# Altium schematic sheet Sheet1.SchDoc: ELECTENG 770 Smart Scale Interface Board
size A4; Author: Andy Woo; Revision: 2.1; SheetNumber: 1; SheetTotal: 1; ENG_APP_DATE: --/--/--; DSN_APP_DATE: --/--/--; CHK_APP_DATE: --/--/--
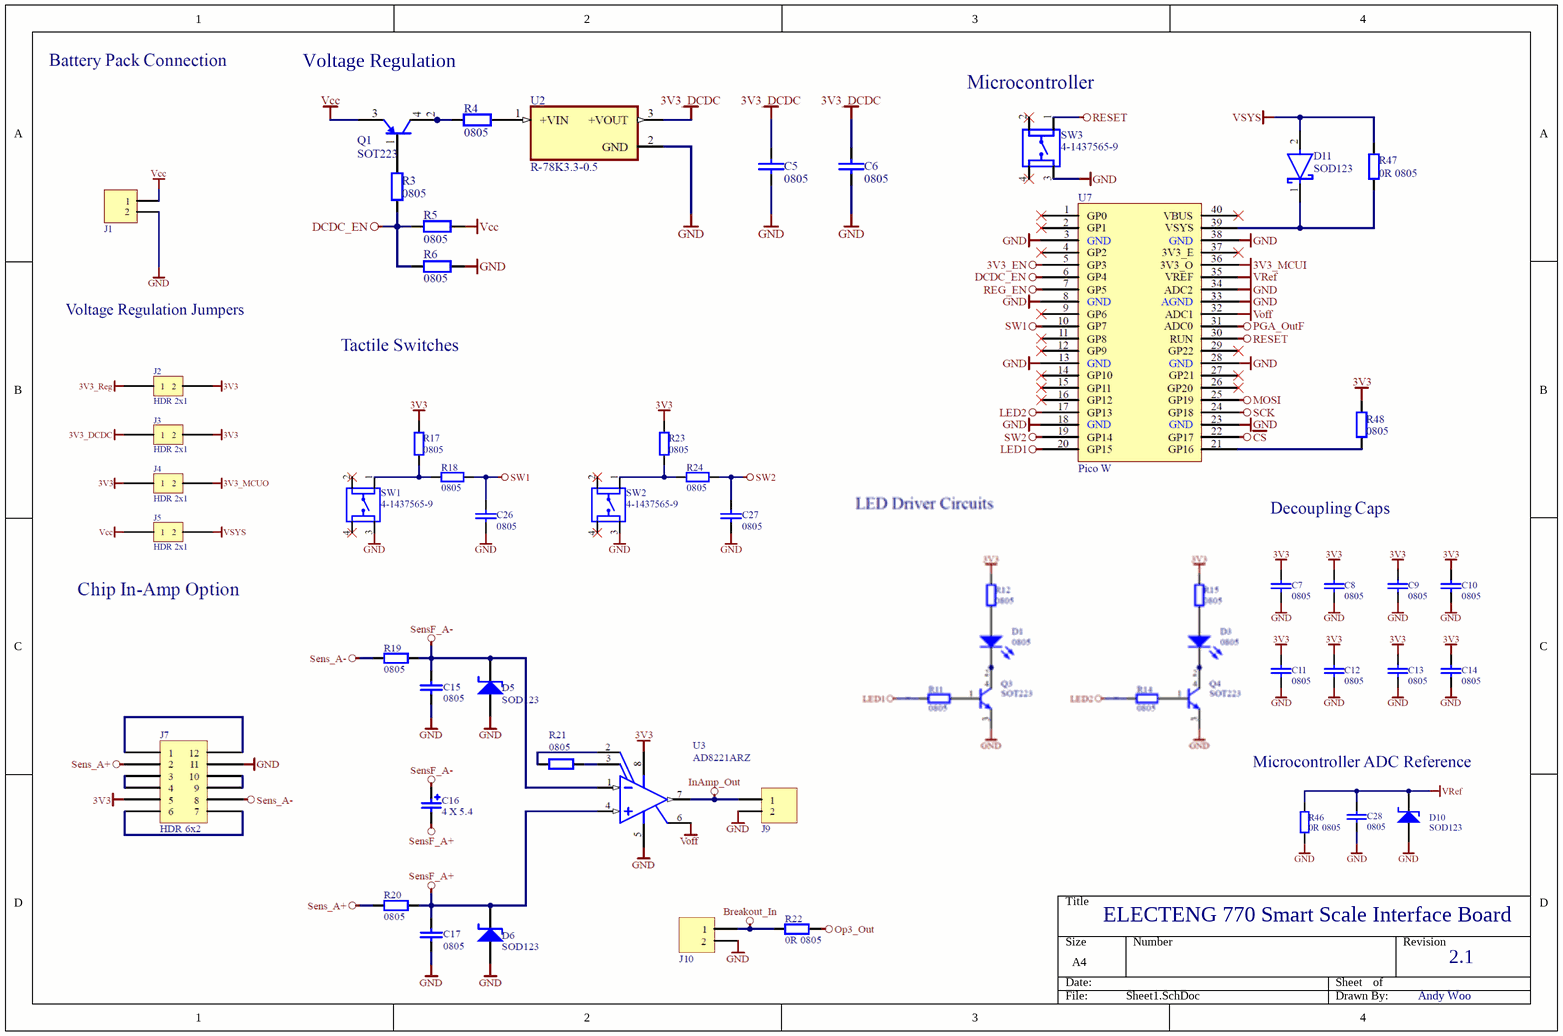
[diagram p0: Sheet1.SchDoc]

## Notes on the sheet
- Voltage Regulation
- Title:
- Author:
- Date:
- Time:
- Revision:
- Sheet
- of
- File: